# Altium schematic sheet S7CAS-PLEIADES-CARTE-MERE_Pxx_DEBUG.SchDoc
size Tabloid; SheetNumber: 5; SheetTotal: 6; Sheet_Name: Insert name in Document Parameters; Size: 11x17
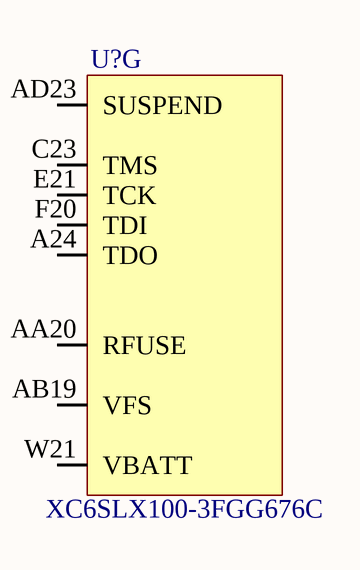
[diagram p0: S7CAS-PLEIADES-CARTE-MERE_Pxx_DEBUG.SchDoc]

## Parts
U?  XC6SLX100-3FGG676C  [FPGA_XILINX_FGG676]  (part G of 10)

## Nets

Not connected (* = marked no-connect by the designer): U? A24(TDO) AA20(RFUSE) AB19(VFS) AD23(SUSPEND) C23(TMS) E21(TCK) F20(TDI) W21(VBATT)

## Notes on the sheet
- Sheet Name
- Project Title
- Global Project
- Size
- Group
- Revision
- Date
- Sheet
- of
- Filename
- Designers

## Library data of the parts
U? = FPGA_XC6SLX100-3FGG676C: FPGA - XILINX SPARTAN 6 480 I/O - BGA-676; Voltage: 1.14 V ~ 1.26 V; Current: *; Power: *; Mfg: Xilinx; Mfg Part Number: XC6SLX100-3FGG676C; HelpURL: https://www.xilinx.com/support/documentation/data_sheets/ds162.pdf; CreatedBy: Jonathan Bouchard; Temperature: 0°C ~ 85°C (TJ); Value: *; Precision: *; Package: BGA-676; Supplier 1: Digikey; Supplier Part Number 1: 122-1760-ND